# Altium schematic sheet Common_Source_Inductor_Balancer.SchDoc
size A; SheetNumber: 1; SheetTotal: 1
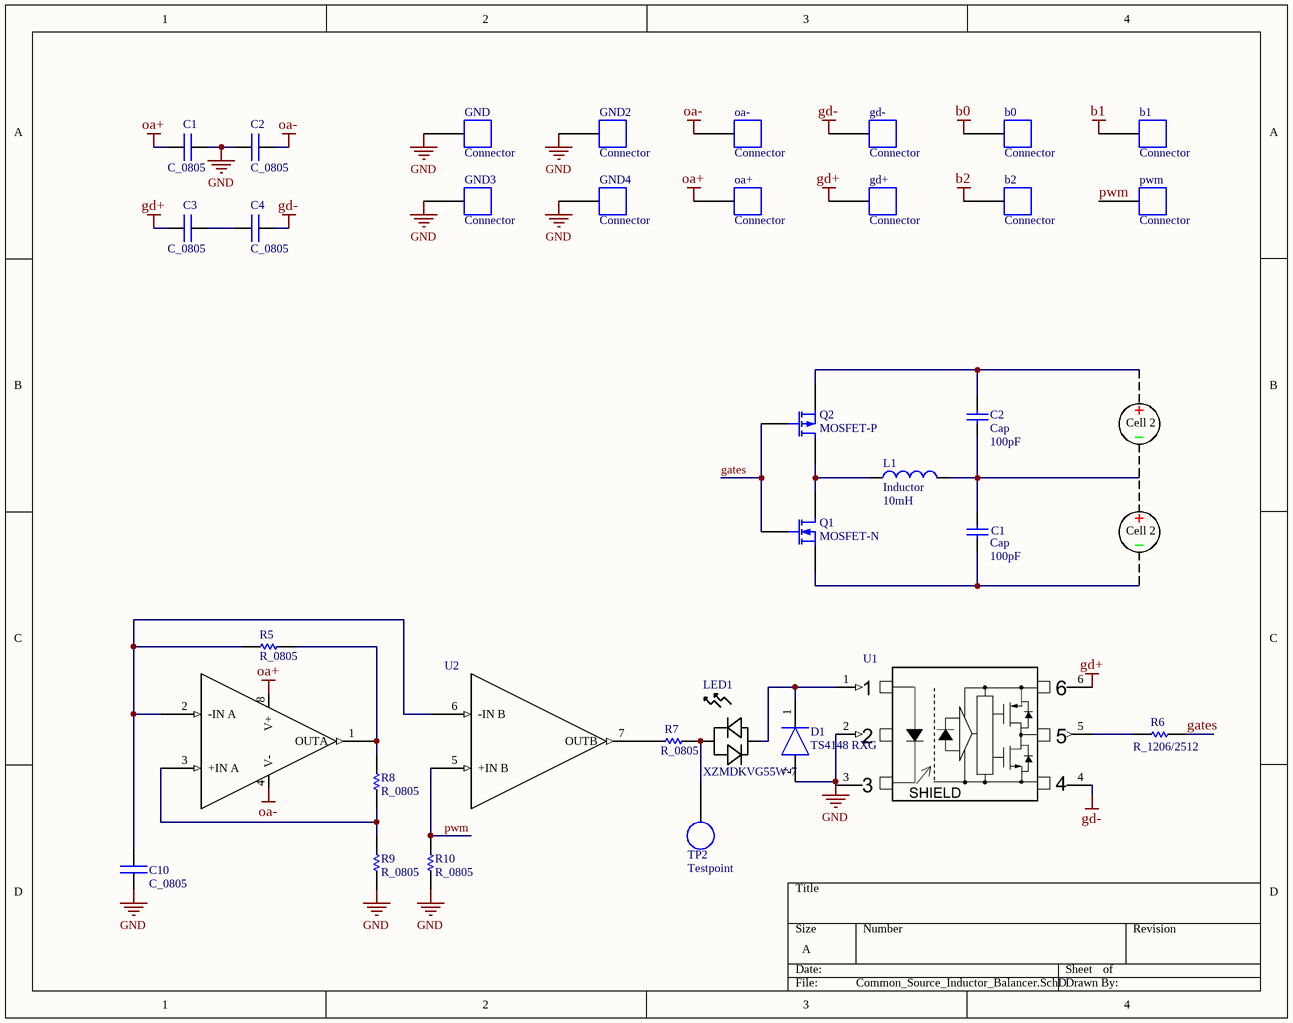
[diagram p0: Common_Source_Inductor_Balancer.SchDoc]

## Parts
(Parts that share a designator on the sheet are numbered #1, #2 ... from top to bottom, then left to right.)
b0  Connector  [connector_large]  (no BOM)
b1  Connector  [connector_large]  (no BOM)
b2  Connector  [connector_large]  (no BOM)
C1#1  C_0805  [CAPC2012X14N]
C1#2  Cap  value 100pF  [RAD-0.3]
C2#1  C_0805  [CAPC2012X14N]
C2#2  Cap  value 100pF  [RAD-0.3]
C3  C_0805  [CAPC2012X14N]
C4  C_0805  [CAPC2012X14N]
C10  C_0805  [CAPC2012X14N]
D1  TS4148 RXG  [DIOC3215X08N]
gd+  Connector  [connector_small]  (no BOM)
gd-  Connector  [connector_small]  (no BOM)
GND  Connector  [connector_small]  (no BOM)
GND2  Connector  [connector_small]  (no BOM)
GND3  Connector  [connector_small]  (no BOM)
GND4  Connector  [connector_small]  (no BOM)
L1  Inductor  value 10mH  [0402-A]
LED1  XZMDKVG55W-7  [DIOC3216X18N]
oa+  Connector  [connector_small]  (no BOM)
oa-  Connector  [connector_small]  (no BOM)
pwm  Connector  [connector_small]  (no BOM)
Q1  MOSFET-N  [E3]
Q2  MOSFET-P  [E3]
R5  R_0805  [RESC2012X06N]
R6  R_1206/2512  [RESC6331X06N]
R7  R_0805  [RESC2012X06N]
R8  R_0805  [RESC2012X06N]
R9  R_0805  [RESC2012X06N]
R10  R_0805  [RESC2012X06N]
TP2  Testpoint  [testpoint]  (no BOM)
U1  TLP5774  [SOIC127P1000X220-6N]  (value not drawn)
U2  OPA2197  [SOIC127P600X175-8N]  (value not drawn)

## Nets
b0: b0.1
b1: b1.1
b2: b2.1
gd+: C3.1 gd+.1 U1.6(VCC)
gd-: C4.2 gd-.1 U1.4(GND)
GND: C1#1.2 C2#1.1 C10.2 D1.2(A) GND.1 GND2.1 GND3.1 GND4.1 R9.1 R10.1 U1.2(N.C.) U1.3(Cathode)
oa+: C1#1.1 oa+.1 U2.8(V+)
oa-: C2#1.2 oa-.1 U2.4(V-)
gates: Q1.2(G) Q2.2(G) R6.2
pwm: pwm.1 R10.2 U2.5(+IN_B)
NetC1#2_1: C1#2.1 Q1.3(S)
NetC1#2_2: C1#2.2 C2#2.1 L1.2
NetC2#2_2: C2#2.2 Q2.3(S)
NetC3_2: C3.2 C4.1
NetC10_1: C10.1 R5.2 U2.2(-IN_A) U2.6(-IN_B)
NetD1_1: D1.1(C) LED1.2 U1.1(Anode)
NetL1_1: L1.1 Q1.1(D) Q2.1(D)
NetLED1_1: LED1.1 R7.2 TP2.1
NetR5_1: R5.1 R8.1 U2.1(OUTA)
NetR6_1: R6.1 U1.5(VO)
NetR7_1: R7.1 U2.7(OUTB)
NetR8_2: R8.2 R9.2 U2.3(+IN_A)

## Notes on the sheet
- Cell 2

## Library data of the parts
C1#2 C2#2 = Cap: Capacitor; Published: 8-Jun-2000; LatestRevisionDate: 17-Jul-2002; LatestRevisionNote: Re-released for DXP Platform.; PackageReference: RAD-0.3; Publisher: Altium Limited; PackageDescription: Radial Cap, Thru-Hole; 2 Leads; 0.3 in Pin Spacing
L1 = Inductor: Code_IEC: 1005; Published: 8-Jun-2000; LatestRevisionDate: 29-May-2009; LatestRevisionNote: IPC-7351 Footprint Added.; PackageReference: 0402-A; Publisher: Altium Limited; PackageDescription: Chip Inductor; Code_JEITA: 0402
LED1 = XZMDKVG55W-7: No Description Available; Manufacturer_Part_Number: XZMDKVG55W-4; Built_By: EMA_Matt; Vendor: SunLED; SourceLibrary: SunLED_2020-06-23; Type: DEV; Datasheet: https://www.sunledusa.com/products/spec/XZMDKVG55W-4.pdf; Copyright: Copyright (C) 2018 Accelerated Designs. All rights reserved; RefDes: RefDes
Q1 = MOSFET-N: N-Channel MOSFET; Published: 8-Jun-2000; LatestRevisionDate: 17-Jul-2002; LatestRevisionNote: Re-released for DXP Platform.; PackageVersion: 1995/1996; PackageReference: E3; Publisher: Altium Limited; PackageDescription: TO, Flat Index; 3 In-Line, Axial Leads; Body Dia. 4.6mm; Lead Dia. 0.5 mm (max)
Q2 = MOSFET-P: P-Channel MOSFET; Published: 8-Jun-2000; LatestRevisionDate: 17-Jul-2002; LatestRevisionNote: Re-released for DXP Platform.; PackageVersion: 1995/1996; PackageReference: E3; Publisher: Altium Limited; PackageDescription: TO, Flat Index; 3 In-Line, Axial Leads; Body Dia. 4.6mm; Lead Dia. 0.5 mm (max)